# EAGLE design master_shield (EAGLE 5.10)
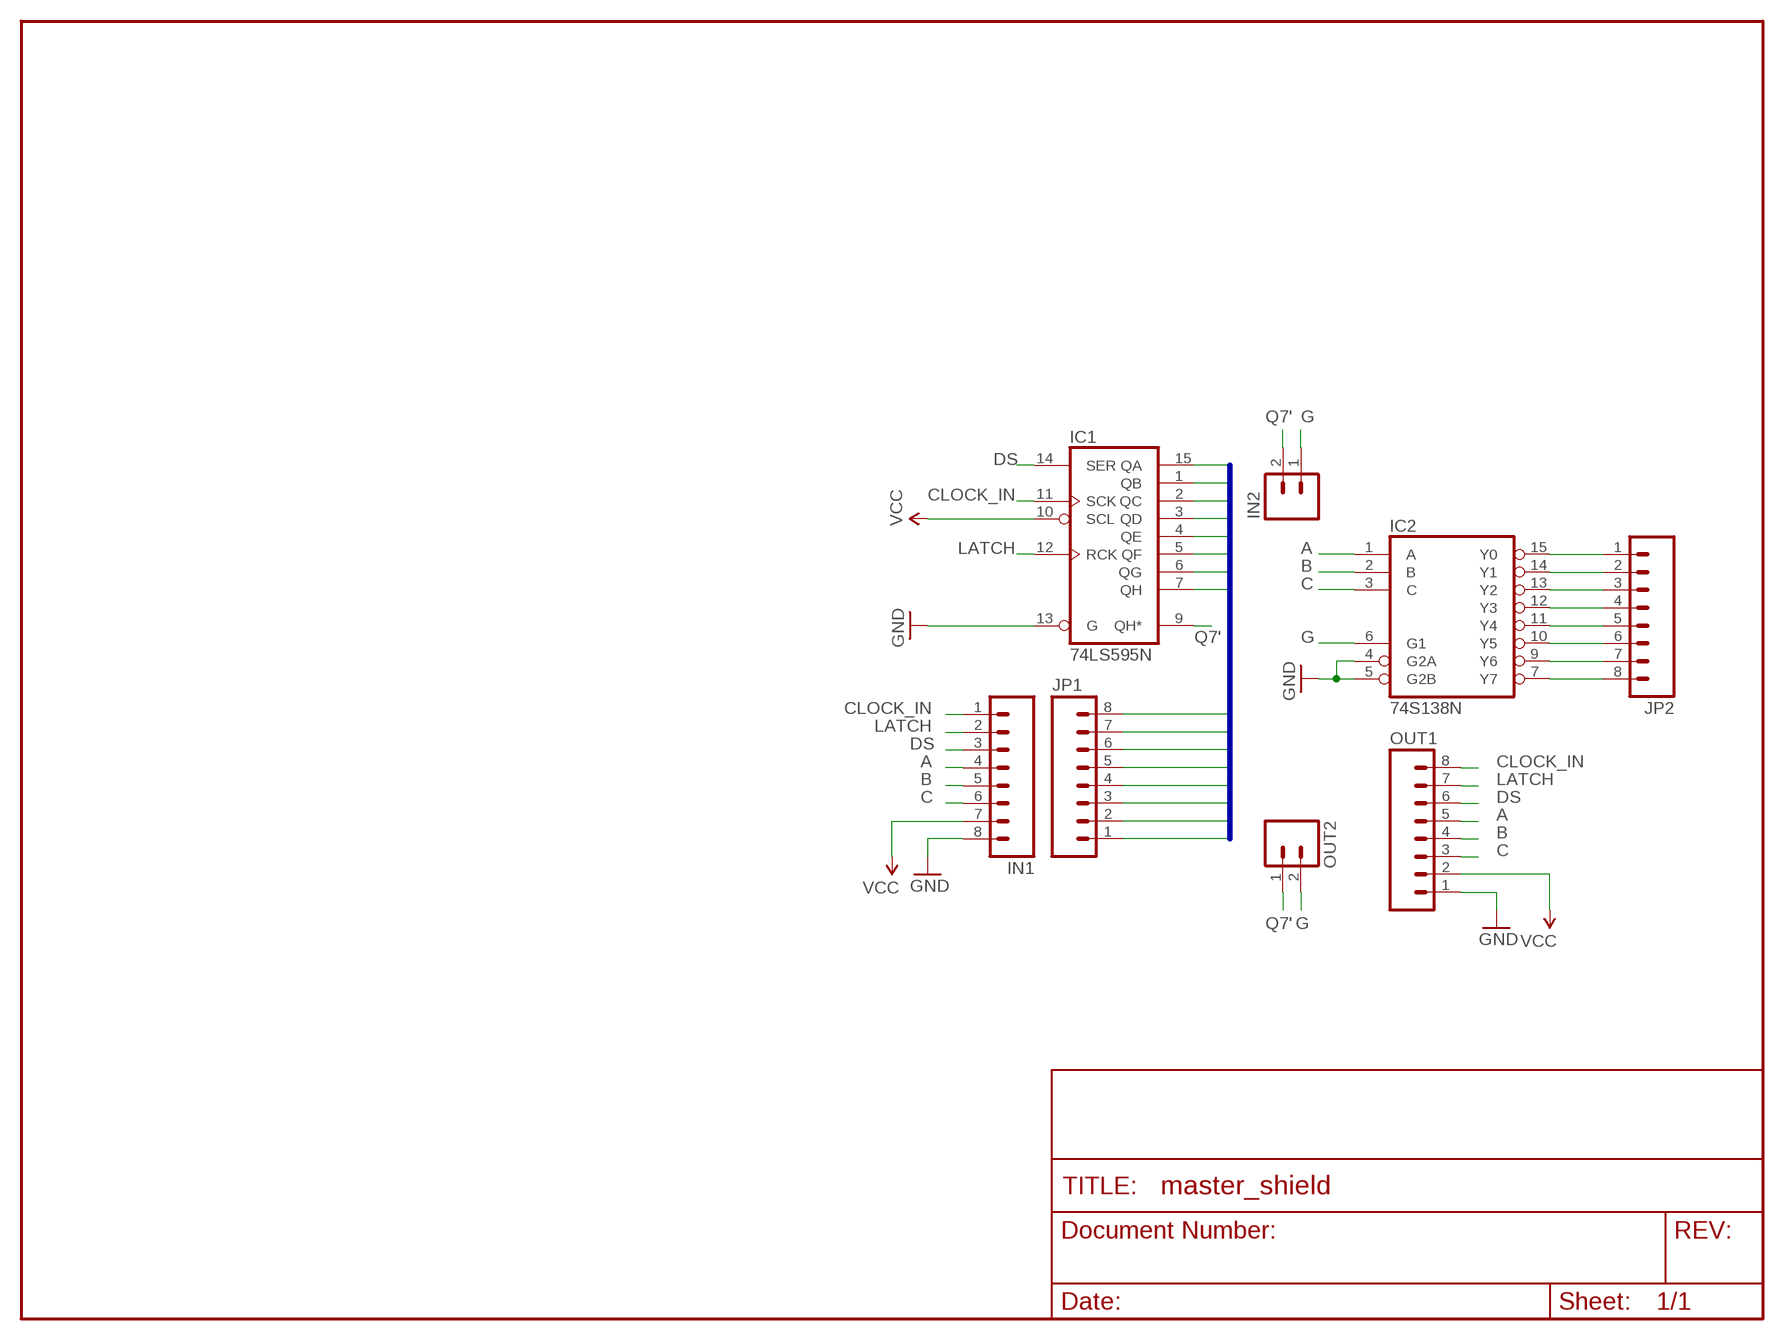
[diagram p0: schematic, sheet 1]

## Parts
IC1  74LS595N  [DIL16]
IC2  74S138N  [DIL16]
IN1  M08  [1X08]
IN2  M02PTH  [1X02]
JP1  M08  [1X08]
JP2  M08  [1X08]
OUT1  M08  [1X08]
OUT2  M02PTH  [1X02]

## Nets
A: IC2.1(A) IN1.4 OUT1.5
B: IC2.2(B) IN1.5 OUT1.4
C: IC2.3(C) IN1.6 OUT1.3
CLOCK_IN: IC1.11(SCK) IN1.1 OUT1.8
DS: IC1.14(SER) IN1.3 OUT1.6
G: IC2.6(G1) IN2.1 OUT2.2
GND: IC1.13(G) IC2.4(G2A) IC2.5(G2B) IN1.8 OUT1.1
LATCH: IC1.12(RCK) IN1.2 OUT1.7
N$1: IC2.15(Y0) JP2.1
N$2: IC2.14(Y1) JP2.2
N$3: IC2.13(Y2) JP2.3
N$4: IC2.12(Y3) JP2.4
N$5: IC2.11(Y4) JP2.5
N$6: IC2.10(Y5) JP2.6
N$7: IC2.9(Y6) JP2.7
N$8: IC2.7(Y7) JP2.8
Q7': IC1.9(QH*) IN2.2 OUT2.1
ROW1: IC1.15(QA) JP1.1
ROW2: IC1.1(QB) JP1.2
ROW3: IC1.2(QC) JP1.3
ROW4: IC1.3(QD) JP1.4
ROW5: IC1.4(QE) JP1.5
ROW6: IC1.5(QF) JP1.6
ROW7: IC1.6(QG) JP1.7
ROW8: IC1.7(QH) JP1.8
VCC: IC1.10(SCL) IN1.7 OUT1.2

## Buses
ROW[1..8]

## Power pins joined to a net without a drawn wire
GND: IC1.8(GND) IC2.8(GND)
VCC: IC1.16(VCC) IC2.16(VCC)

## Library data of the parts
IC1 = 74xx-us:74*595: 8-bit SHIFT REGISTER, output latch
IC2 = 74xx-us:74*138: 3-line to 8-line DECODER/DEMULTIPLEXER
IN1 JP1 JP2 OUT1 = SparkFun:M08: Header 8 Standard 8-pin 0.1" header. Use with straight break away headers (SKU : PRT-00116), right angle break away headers (PRT-00553), swiss pins (PRT-00743), machine pins (PRT-00117), and female headers (PRT-00115).
IN2 OUT2 = SparkFun:M02: Header 2 Standard 2-pin 0.1" header. Use with straight break away headers (SKU : PRT-00116), right angle break away headers (PRT-00553), swiss pins (PRT-00743), machine pins (PRT-00117), and female headers (PRT-00115). Molex polarized connector foot print use with SKU : PRT-08233 with associated crimp pins and housings.

## Board
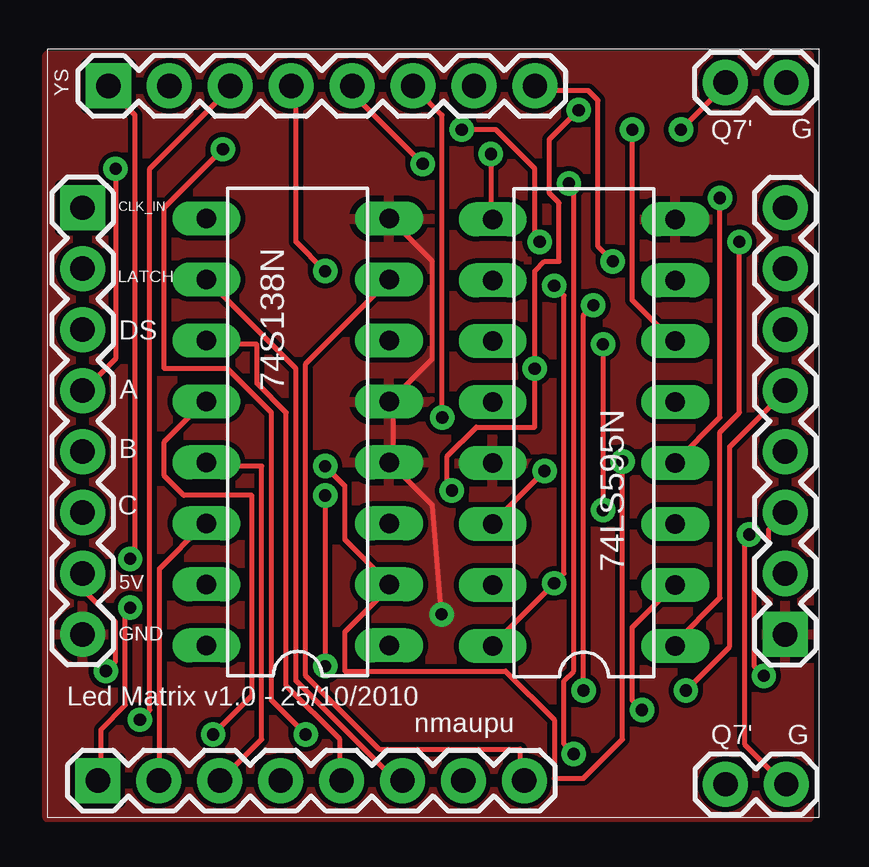
[diagram p1: board, top side]
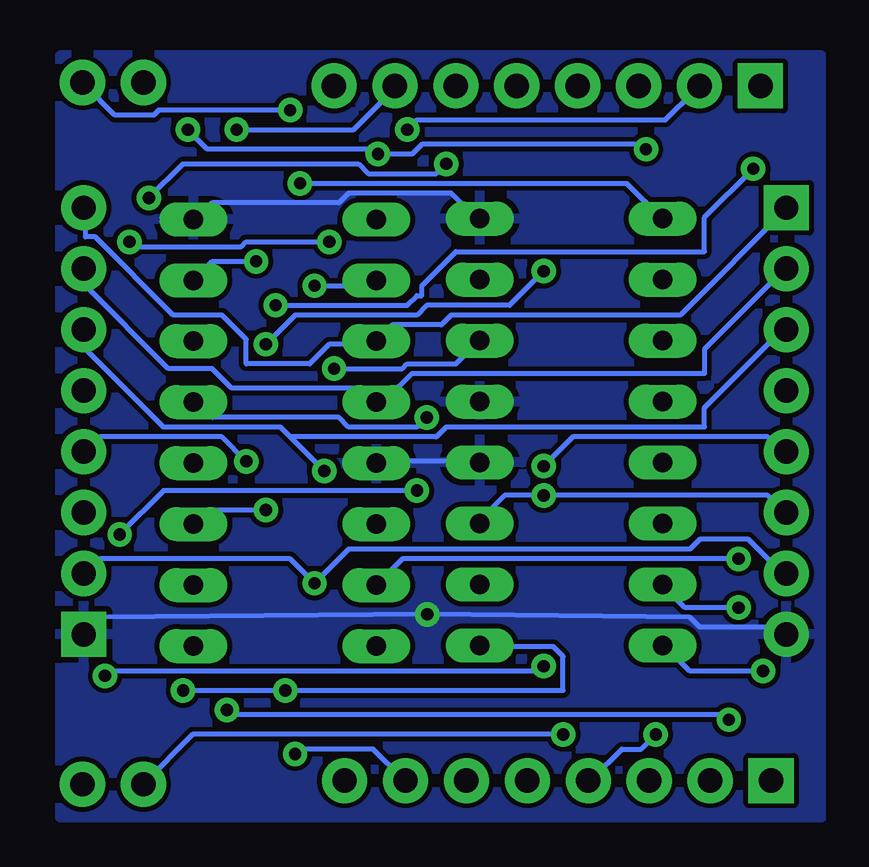
[diagram p2: board, bottom side, seen from below]

No outline drawn. Coordinates in mm, seen from the top.
Copper layers (1*16): Top 0.035mm / dielectric 1.5mm / Bottom 0.035mm
Design rules "sparkfun *": minimum track width 8mil, minimum drill 20mil, track to track 8mil, track to pad 8mil, pad to pad 8mil, via to via 8mil, smd to smd 8mil, copper to edge 10mil, drill to drill 8mil, minimum pad ring 12mil, minimum via ring 10mil, stop-mask expansion 4mil, vias tented up to drill 15mil, thermal gap 10mil

### Footprints (pad centres in the part's own frame; a part is rotated, then mirrored left to right if it is on the bottom)
DIL16 = drill 0.813 long: 1 -8.89,-3.81; 2 -6.35,-3.81; 3 -3.81,-3.81; 4 -1.27,-3.81; 5 1.27,-3.81; 6 3.81,-3.81; 7 6.35,-3.81; 8 8.89,-3.81; 9 8.89,3.81; 10 6.35,3.81; 11 3.81,3.81; 12 1.27,3.81; 13 -1.27,3.81; 14 -3.81,3.81; 15 -6.35,3.81; 16 -8.89,3.81
1X08 = drill 1.016 pad 1.88 square: 1 0,0 | drill 1.016 pad 1.88 round: 2 2.54,0; 3 5.08,0; 4 7.62,0; 5 10.16,0; 6 12.7,0; 7 15.24,0; 8 17.78,0
1X02 = drill 1.016 pad 1.88 round: 1 0,0; 2 2.54,0

### Placement (x,y rotation side)
IC1  22.37,16.03 90 top
IC2  10.44,16.06 90 top
IN1  1.47,25.4 270 top
IN2  30.81,30.62 180 top
JP1  2.54,30.48 0 top
JP2  2.1,1.53 0 top
OUT1  30.76,7.62 90 top
OUT2  28.27,1.38 0 top

### Tracks (layer width: path | path; a pad name or v marks a point on that pad's centre or on a via)
A  (via drill 0.51)
  Top 0.203: v26.62,5.28 28.45,7.11 28.45,15.44 30.68,17.68 OUT1.5 | v2.85,27.03 2.85,19.1 1.63,17.88 IN1.4 | v22.76,21.34 22.35,20.93 v22.35,5.28
  Bottom 0.203: v26.62,5.28 v22.35,5.28 10.77,5.28 10.77,6.71 11.18,7.11 14.22,7.11 IC2.1 | v2.85,27.03 4.88,24.99 4.88,23.57 15.24,23.57 16.66,22.15 16.66,21.74 16.87,21.74 17.27,21.34 v22.76,21.34
B  (via drill 0.51)
  Top 0.203: v11.58,14.63 12.39,13.82 12.39,11.58 14.22,9.75 IC2.2 14.22,9.55 12.39,7.72 12.39,6.1 19.1,6.1 21.13,4.06 21.13,1.63 22.35,1.63 23.98,3.25 v23.98,14.83
  Bottom 0.203: v11.58,14.63 10.36,15.85 2.23,15.85 1.63,15.24 IN1.5 | v23.98,14.83 24.99,15.85 30.07,15.85 30.68,15.24 OUT1.4
C  (via drill 0.51)
  Top 0.203: v29.87,5.89 29.46,6.3 29.46,10.77 30.07,11.38 30.07,11.99 30.68,12.6 OUT1.3 | v11.58,13.41 v11.58,6.3
  Bottom 0.203: IC2.3 14.22,12.39 13.21,13.41 v11.58,13.41 2.23,13.41 1.63,12.8 IN1.6 | v29.87,5.89 29.67,6.1 11.79,6.1 v11.58,6.3
CLOCK_IN
  Bottom 0.203: IN1.1 1.42,25.4 5.89,20.93 15.44,20.93 15.85,20.52 17.88,20.52 18.49,19.91 IC1.11 18.69,19.71 20.52,19.71 21.34,18.9 23.98,18.9 23.98,19.91 24.99,20.93 27.03,20.93 30.28,24.18 30.68,24.18 30.68,25.4 OUT1.8
DS  (via drill 0.51)
  Top 0.203: v20.73,14.43 18.69,12.39 IC1.14
  Bottom 0.203: 22.15,15.85 22.55,16.26 27.43,16.26 30.68,19.51 30.68,20.32 OUT1.6 | 22.15,15.85 v20.73,14.43 | 22.15,15.85 16.05,15.85 15.65,16.26 4.88,16.26 4.88,17.07 1.63,20.32 IN1.3
G  (via drill 0.51)
  Top 0.203: v22.15,29.46 20.93,28.25 20.93,26.01 21.34,25.6 21.34,23.16 20.73,23.16 20.32,22.76 v20.32,18.69 20.32,16.26 17.88,16.26 16.66,15.04 16.66,13.82 v16.87,13.61 | v29.26,11.79 29.06,11.58 29.06,3.05 30.68,1.42 OUT2.2
  Bottom 0.203: v20.32,18.69 17.48,18.69 17.27,18.9 15.24,18.9 14.43,19.71 IC2.6 | v22.15,29.46 27.64,29.46 27.84,29.26 29.46,29.26 30.68,30.48 IN2.1 | v29.26,11.79 27.43,13.61 v16.87,13.61
GND  (via drill 0.51)
  Top 0.203: IC2.8 14.43,24.79 16.05,23.16 16.05,19.1 14.43,17.48 IC2.5 14.43,17.27 14.43,14.83 IC2.4 14.43,14.63 16.05,13.01 v16.43,8.46
  Bottom 0.203: IC1.13 18.49,14.83 14.43,14.83 IC2.4 | IC1.8 26.01,24.99 25.4,25.6 20.12,25.6 19.71,26.01 15.44,26.01 14.43,24.99 IC2.8 | IN1.8 1.63,7.72 1.83,7.92 5.08,7.92 5.49,8.33 v16.43,8.46 30.07,8.33 30.68,7.72 OUT1.1
  pour Bottom: 0,31.75 31.75,31.75 31.75,0 0,0
  pour Top: 0,31.75 31.75,31.75 31.75,0 0,0
LATCH
  Bottom 0.203: OUT1.7 30.68,22.76 30.68,22.15 27.23,18.69 25.4,18.69 24.59,17.88 19.1,17.88 18.69,17.48 IC1.12 18.49,17.48 18.09,17.48 17.07,18.49 4.88,18.49 4.88,19.51 1.63,22.76 IN1.2
N$1  (via drill 0.51)
  Top 0.203: v3.45,8.74 3.25,8.53 3.25,4.67 2.23,3.66 2.23,1.63 JP2.1
  Bottom 0.203: v3.45,8.74 5.69,8.74 6.5,9.55 IC2.15
N$2
  Top 0.203: IC2.14 6.5,12.19 4.67,10.36 4.67,1.63 JP2.2
N$3
  Top 0.203: IC2.13 6.71,14.63 8.94,14.63 8.94,3.25 7.32,1.63 JP2.3
N$4  (via drill 0.51)
  Top 0.203: v6.91,3.45 8.53,5.08 8.53,13.41 5.69,13.41 4.88,14.22 4.88,15.65 6.5,17.27 IC2.12
  Bottom 0.203: v6.91,3.45 7.52,2.85 8.33,2.85 9.55,1.63 JP2.4
N$5
  Top 0.203: IC2.11 6.71,19.71 8.74,19.71 8.74,18.09 9.96,16.87 9.96,5.49 12.19,3.25 12.19,1.63 JP2.5
N$6
  Top 0.203: IC2.10 6.71,22.35 10.36,18.69 10.36,5.69 14.63,1.42 JP2.6
N$7  (via drill 0.51)
  Top 0.203: v21.74,26.42 21.95,26.21 21.95,6.1 21.54,5.69 21.54,3.05 v21.95,2.64
  Bottom 0.203: v21.74,26.42 8.13,26.42 6.71,24.99 IC2.9 | v21.95,2.64 21.74,2.85 18.69,2.85 17.48,1.63 JP2.7
N$8
  Top 0.203: IC2.7 14.22,22.35 10.77,18.9 10.77,5.89 13.82,2.85 19.71,2.85 19.71,1.63 JP2.8
Q7'  (via drill 0.51)
  Top 0.203: v18.49,27.64 18.49,24.99 IC1.9 | v26.42,28.65 28.25,30.48 IN2.2 | v10.77,3.45 9.35,4.88 9.35,16.87 7.52,18.69 4.88,18.69 4.88,25.4 v7.32,27.84
  Bottom 0.203: v26.42,28.65 25.6,27.84 18.69,27.84 v18.49,27.64 17.07,27.64 16.66,28.04 7.52,28.04 v7.32,27.84 | v10.77,3.45 26.21,3.45 28.25,1.42 OUT2.1
ROW1  (via drill 0.51)
  Top 0.203: v3.45,10.77 3.66,10.97 3.66,29.26 2.64,30.28 JP1.1
  Bottom 0.203: v3.45,10.77 17.48,10.77 18.49,9.75 IC1.15
ROW2  (via drill 0.51)
  Top 0.203: v28.85,23.98 28.85,16.87 28.04,16.05 28.04,9.14 26.21,7.32 IC1.1 | v20.52,23.98 20.32,24.18 20.32,27.03 18.69,28.65 v17.27,28.65
  Bottom 0.203: v28.85,23.98 28.65,23.77 24.18,23.77 23.98,23.98 v20.52,23.98 | v17.27,28.65 16.87,29.06 6.5,29.06 5.28,30.28 JP1.2
ROW3  (via drill 0.51)
  Top 0.203: v24.79,4.47 24.38,4.88 24.38,7.92 26.01,9.55 IC1.2 | v3.86,4.06 4.27,4.47 4.27,27.03 7.52,30.28 JP1.3
  Bottom 0.203: v24.79,4.47 24.59,4.27 4.06,4.27 v3.86,4.06
ROW4  (via drill 0.51)
  Top 0.203: v23.16,19.71 v23.16,12.8 | v11.58,22.76 10.36,23.98 10.36,30.28 JP1.4
  Bottom 0.203: v23.16,12.8 25.6,12.8 26.01,12.39 IC1.3 | v23.16,19.71 21.95,20.93 16.87,20.93 16.46,21.34 13.01,21.34 v11.58,22.76
ROW5  (via drill 0.51)
  Top 0.203: v28.04,25.81 28.04,16.66 26.21,14.83 IC1.4 | v15.65,27.23 12.8,30.07 12.8,30.28 JP1.5
  Bottom 0.203: v28.04,25.81 26.62,27.23 19.3,27.23 18.9,26.82 16.05,26.82 v15.65,27.23
ROW6  (via drill 0.51)
  Top 0.203: v16.46,16.66 16.46,29.26 15.44,30.28 JP1.6
  Bottom 0.203: v16.46,16.66 16.87,16.26 19.71,16.26 20.12,16.66 25.4,16.66 26.01,17.27 IC1.5
ROW7  (via drill 0.51)
  Top 0.203: v24.38,28.65 24.38,21.54 26.01,19.91 IC1.6
  Bottom 0.203: v24.38,28.65 19.51,28.65 17.88,30.28 JP1.7
ROW8  (via drill 0.51)
  Top 0.203: v23.57,23.16 22.96,23.77 22.96,29.87 22.55,30.28 20.52,30.28 JP1.8
  Bottom 0.203: v23.57,23.16 25.4,23.16 26.01,22.55 IC1.7
VCC  (via drill 0.51)
  Top 0.203: v2.44,6.1 2.85,6.5 2.85,8.13 1.63,9.35 1.63,10.16 IN1.7 | IC1.16 18.69,7.32 v21.13,9.75 21.54,10.16 21.54,21.74 v21.13,22.15
  Bottom 0.203: v2.44,6.1 5.49,6.1 6.5,7.11 IC2.16 | OUT1.2 30.68,10.16 30.07,10.77 22.15,10.77 v21.13,9.75 19.71,11.18 5.49,11.18 5.08,11.58 3.05,11.58 1.63,10.16 IN1.7 | v21.13,22.15 18.9,22.15 18.69,22.35 IC1.10

### Text on the board
tPlace: Q7' | G | CLK_IN | LATCH | DS | A | B | C | 5V | GND | Led Matrix v1.0 - 25/10/2010 | nmaupu | Q7' | G
tNames: YS